# EAGLE design CO2Monitor V0.3 (EAGLE 9.6.2)
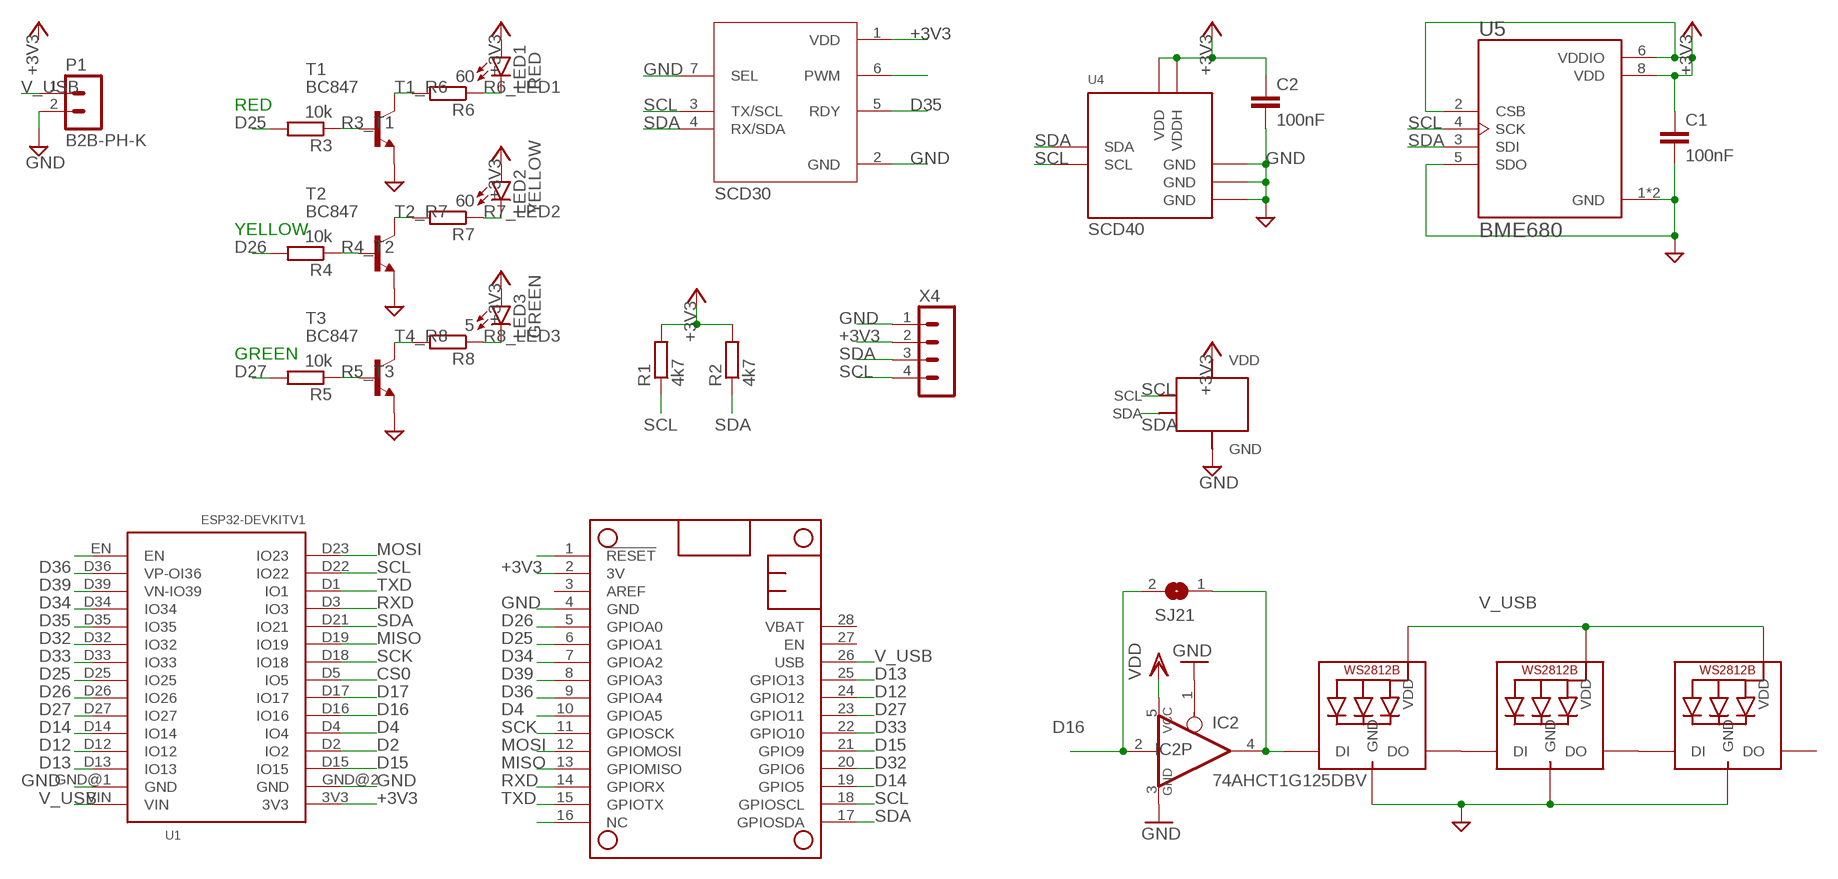
[diagram p0: schematic, sheet 1]

## Parts
C1  100nF  C-EUC0805  [C0805]
C2  100nF  C-EUC0805  [C0805]
IC2  74AHCT1G125DBV  [SOT23-5]
LED1  RED  LED5MM  [LED5MM]
LED2  YELLOW  LED5MM  [LED5MM]
LED3  GREEN  LED5MM  [LED5MM]
LED4  WS2812B5050  [WS2812B]
LED5  WS2812B5050  [WS2812B]
LED6  WS2812B5050  [WS2812B]
MS1  FEATHERWING_FOOTPRINTFOOTPRINT  [FEATHERWING_FOOTPRINT]
P1  B2B-PH-K  [B2B-PH-K]
R1  4k7  R-EU_R0805  [R0805]
R2  4k7  R-EU_R0805  [R0805]
R3  10k  R-EU_R0805  [R0805]
R4  10k  R-EU_R0805  [R0805]
R5  10k  R-EU_R0805  [R0805]
R6  60  R-EU_R0805  [R0805]
R7  60  R-EU_R0805  [R0805]
R8  5  R-EU_R0805  [R0805]
SJ21  SOLDERJUMPER  [SOLDERJUMPER_ARROW_NOPASTE]
T1  BC847  [SOT23]
T2  BC847  [SOT23]
T3  BC847  [SOT23]
U1  ESP32DEVKITV1  [ESP32-DEVKITV1]
U3  SCD30  [MODULE_SCD30]
U4  SCD40  [SCD40]
U5  BME680  [PSON80P300X300X100-8N]
X1  1306_0.96"1306_0.96"_NO_JHOLES  [1306_0.96"_NO_CUT]
X4  B4B-PH-K  [B4B-PH-K]

## Nets
+3V3: C1.1 C2.1 LED1.A LED2.A LED3.A MS1.2(3V) R1.2 R2.2 U1.3V3 U3.1(VDD) U4.P$7(VDD) U4.P$19(VDDH) U5.2(CSB) U5.6(VDDIO) U5.8(VDD) X1.VDD X4.2
CS0: U1.D5(IO5)
D2: U1.D2(IO2)
D4: MS1.10(GPIOA5) U1.D4(IO4)
D12: MS1.24(GPIO12) U1.D12(IO12)
D13: MS1.25(GPIO13) U1.D13(IO13)
D14: MS1.19(GPIO5) U1.D14(IO14)
D15: MS1.21(GPIO9) U1.D15(IO15)
D16: IC2.2(I) SJ21.2 U1.D16(IO16)
D17: U1.D17(IO17)
D25: MS1.6(GPIOA1) R3.2 U1.D25(IO25)
D26: MS1.5(GPIOA0) R4.2 U1.D26(IO26)
D27: MS1.23(GPIO11) R5.2 U1.D27(IO27)
D32: MS1.20(GPIO6) U1.D32(IO32)
D33: MS1.22(GPIO10) U1.D33(IO33)
D34: MS1.7(GPIOA2) U1.D34(IO34)
D35: U1.D35(IO35) U3.5(RDY)
D36: MS1.9(GPIOA4) U1.D36(VP-OI36)
D39: MS1.8(GPIOA3) U1.D39(VN-IO39)
GND: C1.2 C2.2 IC2.1(OE) IC2.3(GND) LED4.3-GND(GND) LED5.3-GND(GND) LED6.3-GND(GND) MS1.4(GND) P1.2 T1.2(E) T2.2(E) T3.2(E) U1.GND@1(GND) U1.GND@2(GND) U3.2(GND) U3.7(SEL) U4.P$6(GND) U4.P$20(GND) U4.P$21(GND) U5.1(GND) U5.5(SDO) U5.7(GND) X1.GND X4.1
MISO: MS1.13(GPIOMISO) U1.D19(IO19)
MOSI: MS1.12(GPIOMOSI) U1.D23(IO23)
N$1: LED4.2-DOUT(DO) LED5.4-DIN(DI)
N$2: U3.6(PWM)
N$3: MS1.16(NC)
N$4: LED5.2-DOUT(DO) LED6.4-DIN(DI)
N$8: MS1.1(!RESET)
N$17: U1.EN
N$22: IC2.4(O) LED4.4-DIN(DI) SJ21.1
R3_T1: R3.1 T1.1(B)
R4_T2: R4.1 T2.1(B)
R5_T3: R5.1 T3.1(B)
R6_LED1: LED1.K(C) R6.1
R7_LED2: LED2.K(C) R7.1
R8_LED3: LED3.K(C) R8.1
RXD: MS1.14(GPIORX) U1.D3(IO3)
SCK: MS1.11(GPIOSCK) U1.D18(IO18)
SCL: MS1.18(GPIOSCL) R1.1 U1.D22(IO22) U3.3(TX/SCL) U4.P$9(SCL) U5.4(SCK) X1.SCL X4.4
SDA: MS1.17(GPIOSDA) R2.1 U1.D21(IO21) U3.4(RX/SDA) U4.P$10(SDA) U5.3(SDI) X1.SDA X4.3
T1_R6: R6.2 T1.3(C)
T2_R7: R7.2 T2.3(C)
T4_R8: R8.2 T3.3(C)
TXD: MS1.15(GPIOTX) U1.D1(IO1)
V_USB: IC2.5(VCC) LED4.1-VDD(VDD) LED5.1-VDD(VDD) LED6.1-VDD(VDD) MS1.26(USB) P1.1 U1.VIN ; supply symbol labelled VDD
Unconnected: LED6.2-DOUT(DO) MS1.3(AREF) MS1.27(EN) MS1.28(VBAT)

## Notes on the sheet
- RED
- YELLOW
- GREEN

## Library data of the parts
C1 C2 = rcl:C-EU: CAPACITOR, European symbol; SPICEPREFIX: C
IC2 = 74xx-little-us:74*1G125: Single Bus Buffer Gate with 3-State Output
LED1-LED3 = led:LED: LED OSRAM: - CHIPLED LG R971, LG N971, LY N971, LG Q971, LY Q971, LO R971, LY R971 LH N974, LH R974 LS Q976, LO Q976, LY Q976 LO Q996 - Hyper CHIPLED LW Q18S LB Q993, LB Q99A, LB R99A - SideLED LS A670, LO A670, LY A670, LG A670, LP A670 LB A673, LV A673, LT A673, LW A673 LH A674 LY A675 LS A676, LA A676, LO A676, LY A676, LW A676 LS A679, LY A679, LG A679 - Hyper Micro SIDELED® LS Y876, LA Y876, LO Y876, LY Y876 LT Y87S - SmartLED LW L88C, LW L88S LB L89C, LB L89S, LG L890 LS L89K, LO L89K, LY L89K LS L896, LA L896, LO L896, LY L896 - TOPLED LS T670, LO T670, LY T670, LG T670, LP T670 LSG T670, LSP T670, LSY T670, LOP T670, LYG T670 LG T671, LOG T671, LSG T671 LB T673, LV T673, LT T673, LW T673 LH T674 LS T676, LA T676, LO T676, LY T676, LB T676, LH T676, LSB T676, LW T676 LB T67C, LV T67C, LT T67C, LS T67K, LO T67K, LY T67K, LW E67C LS E67B, LA E67B, LO E67B, LY E67B, LB E67C, LV E67C, LT E67C LW T67C LS T679, LY T679, LG T679 LS T770, LO T770, LY T770, LG T770, LP T770 LB T773, LV T773, LT T773, LW T773 LH T774 LS E675, LA E675, LY E675, LS T675 LS T776, LA T776, LO T776, LY T776, LB T776 LHGB T686 LT T68C, LB T68C - Hyper Mini TOPLED® LB M676 - Mini TOPLED Santana® LG M470 LS M47K, LO M47K, LY M47K Source: http://www.osram.convergy.de LUXEON: - LUMILED® LXK2-PW12-R00, LXK2-PW12-S00, LXK2-PW14-U00, LXK2-PW14-V00 LXK2-PM12-R00, LXK2-PM12-S00, LXK2-PM14-U00 LXK2-PE12-Q00, LXK2-PE12-R00, LXK2-PE12-S00, LXK2-PE14-T00, LXK2-PE14-U00 LXK2-PB12-K00, LXK2-PB12-L00, LXK2-PB12-M00, LXK2-PB14-N00, LXK2-PB14-P00, LXK2-PB14-Q00 LXK2-PR12-L00, LXK2-PR12-M00, LXK2-PR14-Q00, LXK2-PR14-R00 LXK2-PD12-Q00, LXK2-PD12-R00, LXK2-PD12-S00 LXK2-PH12-R00, LXK2-PH12-S00 LXK2-PL12-P00, LXK2-PL12-Q00, LXK2-PL12-R00 Source: www.luxeon.com KINGBRIGHT: KA-3528ASYC Source: www.kingbright.com
LED4-LED6 = WS2812B:WS2812B: Check prices <https://pricing.snapeda.com/parts/WS2812B/Worldsemi/view-part?ref=eda>; AVAILABILITY: Not in stock; DESCRIPTION: Raspberry Pi HAT (40 pin) Wheeled Robotics Kit; MF: Worldsemi; MP: WS2812B; PACKAGE: None; PRICE: None
MS1 = FeatherWing:FEATHERWING_FOOTPRINT
P1 = con-jst-ph:B2B-PH-K: HEADER
R1-R8 = rcl:R-EU_: RESISTOR, European symbol; SPICEPREFIX: R
SJ21 = microbuilder:SOLDERJUMPER: SMD Solder JUMPER Solder the two pads together to create a connection, or remove the solder to break it. REFLOW - Use this footprint for solder paste and reflow ovens. WAVE - Use this footprint for hand-soldering (larger pads). CLOSED - Has a trace between the two pads to ensure it is closed by default. The trace needs to be cut to disable the jumper, and can be closed again by creating a solder bridge between the two pads.; BOM: EXCLUDE
T1-T3 = transistor:BC847: NPN TRANSISTOR
U1 = ESP32-DEVKITV1:ESP32DEVKITV1
U3 = SCD30:SCD30: SCD30 Series 5.5 V 75 mA ±3% Carbon Dioxide (CO2) Sensor Module Check prices <https://pricing.snapeda.com/parts/SCD30/Sensirion%20AG/view-part?ref=eda>; AVAILABILITY: In Stock; DESCRIPTION: Carbon Dioxide (CO2) Sensor I²C, Modbus, PWM; MF: Sensirion AG; MP: SCD30; PACKAGE: None; PRICE: None; PURCHASE-URL: https://pricing.snapeda.com/search/part/SCD30/?ref=eda
U4 = SCD40:SCD40
U5 = BME680:BME680: Integrated Environmental Unit Check prices <https://pricing.snapeda.com/parts/BME680/Bosch%20Sensortec/view-part?ref=eda>; AVAILABILITY: In Stock; DESCRIPTION: Gas, Humidity, Pressure, Temperature Sensor I²C, SPI Output; MF: Bosch Sensortec; MP: BME680; PACKAGE: LGA-8 Bosch Tools; PRICE: None; PURCHASE-URL: https://pricing.snapeda.com/search/part/BME680/?ref=eda
X1 = SSD1306:1306_0.96"
X4 = con-jst-ph:B4B-PH-K: HEADER

## Board
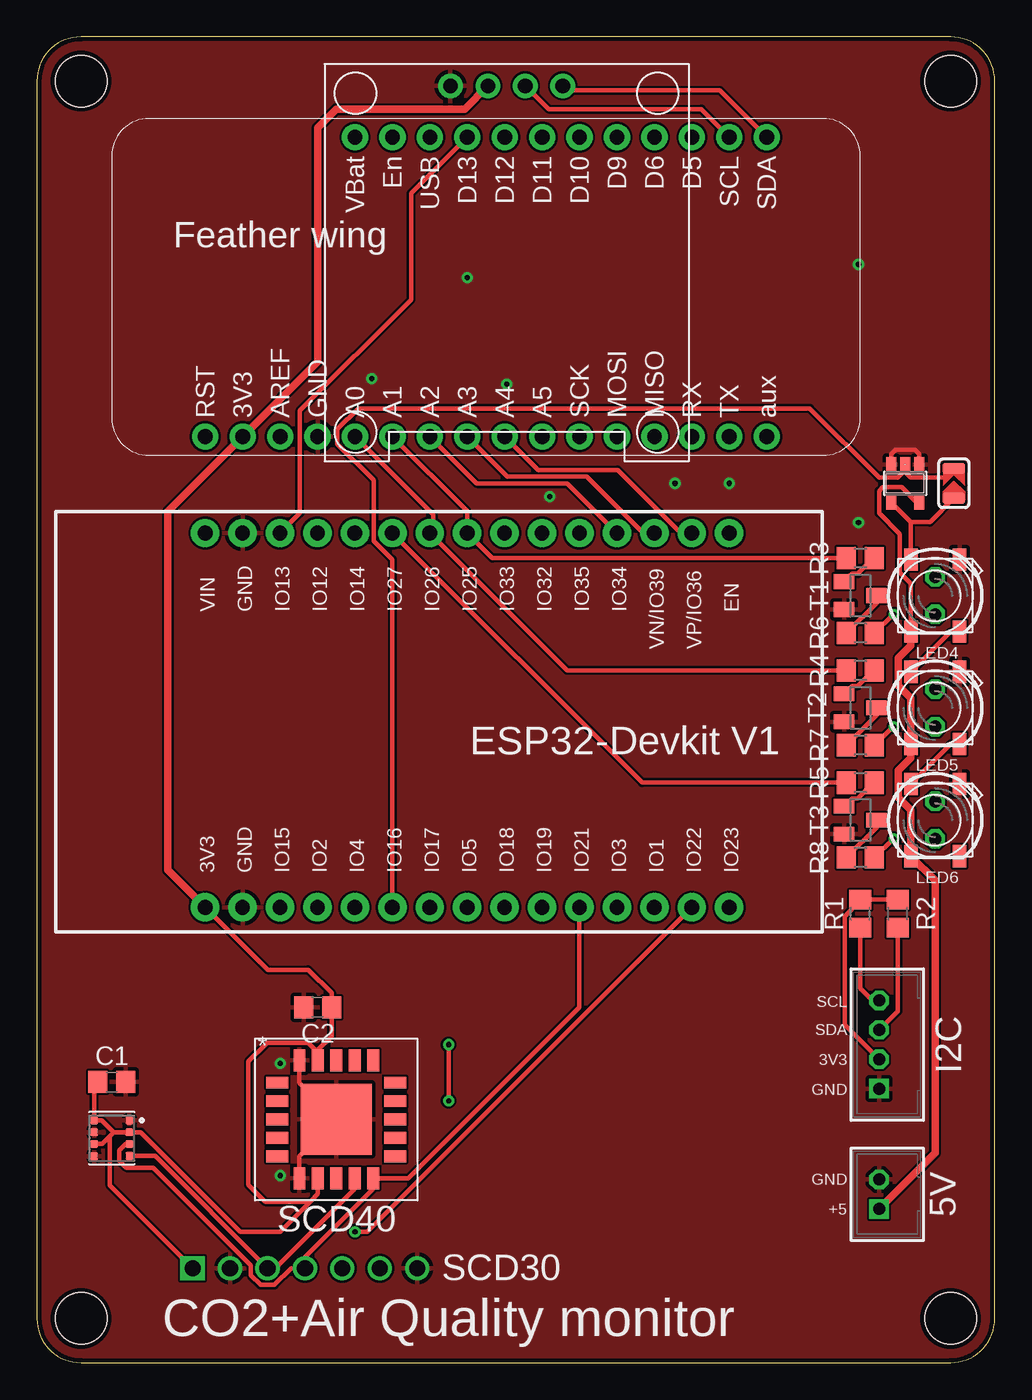
[diagram p1: board, top side]
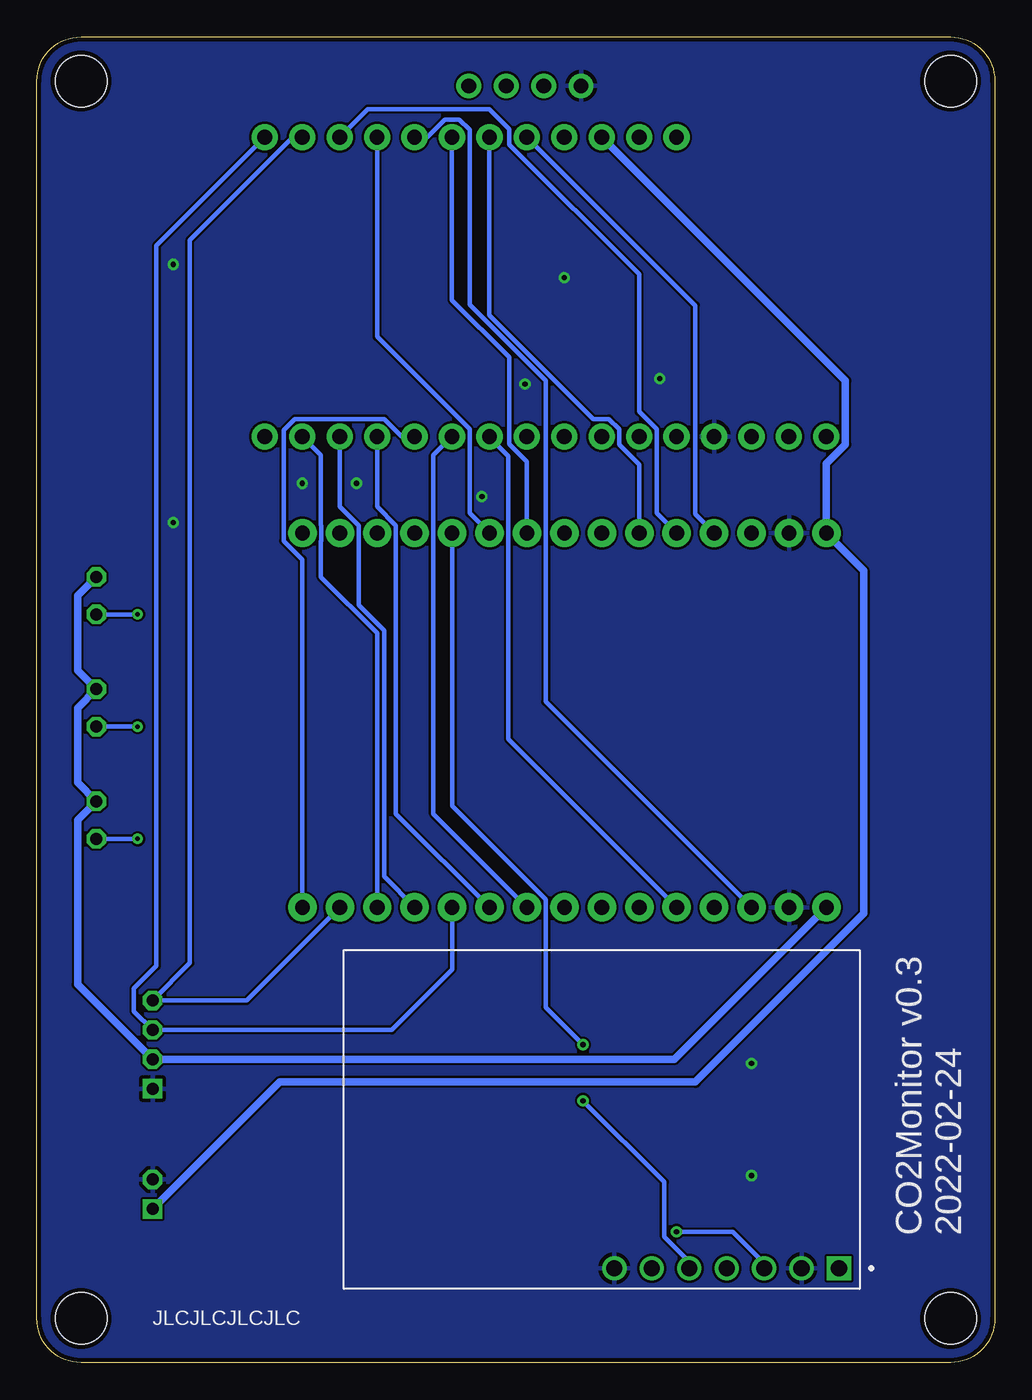
[diagram p2: board, bottom side, seen from below]

Size 65 x 90 mm. Coordinates in mm from the lower left corner, seen from the top.
Outline: 62,90 3,90 arc90 0,87 0,3 arc90 3,0 62,0 arc90 65,3 65,87 arc90 62,90
Copper layers (1*16): Top 0.035mm / dielectric 1.5mm / Bottom 0.035mm
Design rules "Seeed": minimum track width 6mil, minimum drill 0.3mm, track to track 6mil, track to pad 6mil, pad to pad 6mil, via to via 12mil, smd to smd 6mil, copper to edge 12mil, drill to drill 6mil, minimum pad ring 10mil, minimum via ring 8mil, stop-mask expansion 4mil, vias tented up to drill 20mil, thermal gap 10mil
Holes 3.5 mm at 3,3 62,3 62,87 3,87

### Footprints (pad centres in the part's own frame; a part is rotated, then mirrored left to right if it is on the bottom)
C0805 = smd 1.3 x 1.5: 1 -0.95,0; 2 0.95,0
SOT23-5 = smd 0.69 x 0.99: 1 -0.95,-1.29; 2 0,-1.29; 3 0.95,-1.29; 4 0.95,1.3; 5 -0.95,1.3
LED5MM = drill 0.813 octagon: A -1.27,0; K 1.27,0
WS2812B = smd 1.5 x 0.9: 1-VDD 2.45,-1.65; 2-DOUT 2.45,1.65; 3-GND -2.45,1.65; 4-DIN -2.45,-1.65
FEATHERWING_FOOTPRINT = drill 1 pad 1.778: 1 6.35,1.27; 2 8.89,1.27; 3 11.43,1.27; 4 13.97,1.27; 5 16.51,1.27; 6 19.05,1.27; 7 21.59,1.27; 8 24.13,1.27; 9 26.67,1.27; 10 29.21,1.27; 11 31.75,1.27; 12 34.29,1.27; 13 36.83,1.27; 14 39.37,1.27; 15 41.91,1.27; 16 44.45,1.27; 17 44.45,21.59; 18 41.91,21.59; 19 39.37,21.59; 20 36.83,21.59; 21 34.29,21.59; 22 31.75,21.59; 23 29.21,21.59; 24 26.67,21.59; 25 24.13,21.59; 26 21.59,21.59; 27 19.05,21.59; 28 16.51,21.59
B2B-PH-K = drill 0.813 square: 1 -1,0 | drill 0.813 octagon: 2 1,0
R0805 = smd 1.3 x 1.5: 1 -0.95,0; 2 0.95,0
SOLDERJUMPER_ARROW_NOPASTE = smd 0.762 x 1.524: 1 -1.016,0; 2 1.016,0
SOT23 = smd 1 x 1.4: 1 -0.95,-1.1; 2 0.95,-1.1; 3 0,1.1
ESP32-DEVKITV1 = drill 1 pad 1.93: 3V3 -16.52,-12.27; D1 13.96,-12.27; D2 -8.9,-12.27; D3 11.42,-12.27; D4 -6.36,-12.27; D5 1.26,-12.27; D12 -8.9,13.135; D13 -11.44,13.135; D14 -6.36,13.135; D15 -11.44,-12.27; D16 -3.82,-12.27; D17 -1.28,-12.27; D18 3.8,-12.27; D19 6.34,-12.27; D21 8.88,-12.27; D22 16.5,-12.27; D23 19.04,-12.27; D25 1.26,13.135; D26 -1.28,13.135; D27 -3.82,13.135; D32 6.34,13.135; D33 3.8,13.135; D34 11.42,13.135; D35 8.88,13.135; D36 16.5,13.135; D39 13.96,13.135; EN 19.04,13.135; GND@1 -13.98,13.135; GND@2 -13.98,-12.27; VIN -16.52,13.135
MODULE_SCD30 = drill 1.1 square: 1 -16.1,10.1 | drill 1.1: 2 -13.56,10.1; 3 -11.02,10.1; 4 -8.48,10.1; 5 -5.94,10.1; 6 -3.4,10.1; 7 -0.86,10.1
SCD40 = smd 1.5 x 0.8: P$1 -4,2.5; P$2 -4,1.25; P$3 -4,0; P$4 -4,-1.25; P$5 -4,-2.5; P$11 4,-2.5; P$12 4,-1.25; P$13 4,0; P$14 4,1.25; P$15 4,2.5 | smd 0.8 x 1.5: P$6 -2.5,-4; P$7 -1.25,-4; P$8 0,-4; P$9 1.25,-4; P$10 2.5,-4; P$16 2.5,4; P$17 1.25,4; P$18 0,4; P$19 -1.25,4; P$20 -2.5,4 | smd 4.8 x 4.8: P$21 0,0
PSON80P300X300X100-8N = smd 0.5 x 0.5: 1 1.2,1.2; 2 1.2,0.4; 3 1.2,-0.4; 4 1.2,-1.2; 5 -1.2,-1.22; 6 -1.2,-0.4; 7 -1.2,0.4; 8 -1.2,1.2
1306_0.96"_NO_CUT = drill 1 pad 1.676: GND -3.81,12; SCL 1.27,12; SDA 3.81,12; VDD -1.27,12
B4B-PH-K = drill 0.813 square: 1 -3,0 | drill 0.813 octagon: 2 -1,0; 3 1,0; 4 3,0

### Placement (x,y rotation side)
C1  5.08,19.05 0 top
C2  19.05,24.13 180 top
IC2  58.93,59.69 180 top
LED1  60.96,52.07 270 top
LED2  60.96,44.45 270 top
LED3  60.96,36.83 270 top
LED4  60.96,52.07 270 top
LED5  60.96,44.45 270 top
LED6  60.96,36.83 270 top
MS1  5.08,61.59 0 top
P1  57.15,11.43 90 top
R1  55.88,30.48 90 top
R2  58.42,30.48 90 top
R3  55.88,54.61 180 top
R4  55.88,46.99 180 top
R5  55.88,39.37 180 top
R6  55.88,49.53 180 top
R7  55.88,41.91 180 top
R8  55.88,34.29 180 top
SJ21  62.23,59.69 90 top
T1  55.88,52.07 270 top
T2  55.88,44.45 270 top
T3  55.88,36.83 270 top
U1  27.94,43.18 0 top
U3  26.67,16.51 180 bottom
U4  20.32,16.51 0 top
U5  5.08,15.24 0 top
X1  31.88,74.67 0 top
X4  57.15,21.59 90 top

### Tracks (layer width: path | path; a pad name or v marks a point on that pad's centre or on a via)
+3V3
  Top 0.305: R2.2 R1.2 55.88,31.36 54.83,30.31 54.83,22.91 X4.2 | 5.21,15.62 4.39,16.44 U5.8 3.88,18.8 C1.1 | 5.21,15.62 6.26,15.62 U5.2 7.06,15.65 13.82,8.89 16.51,8.89 18.54,10.92 | U5.6 4.43,14.84 4.95,15.37 | 4.95,15.37 5.21,15.62 | U3.1 4.95,12.03 4.95,15.37 | 18.54,10.92 19.07,11.45 U4.P$7 | 18.54,10.92 15.49,10.92 14.35,12.06 14.35,20.45 15.62,21.72 18.41,21.72 19.07,21.06 U4.P$19 19.07,21.23 20,22.16 C2.1 20,25.09 18.41,26.67 15.66,26.67 11.64,30.69 U1.3V3
  Top 0.508: 11.64,30.69 8.89,33.44 8.89,57.78 MS1.2 19.05,67.94 19.05,83.82 20.32,85.09 29.02,85.09 X1.VDD
  Bottom 0.508: U1.3V3 21.74,20.59 X4.2 62.23,25.67 62.23,36.83 LED3.A 62.23,39.37 62.23,44.45 LED2.A 62.23,46.99 62.23,52.07 LED1.A
D4
  Bottom 0.305: MS1.10 34.29,62.82 33.01,61.54 33.01,42.34 U1.D4
D12
  Bottom 0.305: U1.D12 20.32,57.59 20.32,71.75 MS1.24
D13
  Top 0.305: U1.D13 17.86,57.67 17.86,64.63 25.4,72.17 25.4,79.38 MS1.25
D14
  Bottom 0.305: U1.D14 22.94,57.67 22.94,63.36 24.13,64.55 24.13,73.88 32.94,82.69 32.94,83.74 34.29,85.09 42.55,85.09 MS1.19
D15
  Bottom 0.305: MS1.21 38.52,83.19 37.32,84.38 36.34,84.38 35.64,83.68 35.64,71.82 30.48,66.66 30.48,56.85 30.47,56.84 30.47,44.88 U1.D15
D16
  Top 0.305: SJ21.2 61.59,60.07 59.31,60.07 58.93,60.45 IC2.2 58.93,60.58 58.42,60.07 57.15,60.07 52.45,64.77 21.81,64.77 20.4,63.36 20.4,62.37 22.85,59.92 22.85,55.79 24.12,54.52 U1.D16
D25
  Top 0.305: R3.2 30.91,54.61 U1.D25 29.2,57.8 MS1.6
D26
  Top 0.305: R4.2 35.98,46.99 26.88,56.09 | 26.88,56.09 U1.D26 | MS1.5 26.88,57.57 26.88,56.09
D27
  Top 0.305: R5.2 41.06,39.37 U1.D27
  Bottom 0.305: MS1.23 34.29,71.12 27.23,64.06 26.18,64.06 25.48,63.36 25.48,62.31 24.12,60.95 U1.D27
D32
  Bottom 0.305: U1.D32 35.64,57.67 35.64,63.36 41.91,69.63 MS1.20
D33
  Bottom 0.305: MS1.22 36.83,72.14 32.94,68.25 32.94,62.37 31.74,61.17 U1.D33
D34
  Top 0.305: MS1.7 29.84,59.69 35.98,59.69 U1.D34
D35  (via drill 0.35)
  Top 0.305: v27.94,17.78 v27.94,21.59
  Bottom 0.305: U1.D35 36.82,37.79 30.47,31.44 30.47,24.12 v27.94,21.59 | U3.5 20.73,6.85 22.43,8.54 22.43,12.27 v27.94,17.78
D36
  Top 0.305: MS1.9 34.01,60.6 39.41,60.6 43.7,56.31 U1.D36
D39
  Top 0.305: MS1.8 31.93,60.15 37.32,60.15 41.16,56.31 U1.D39
GND  (via drill 0.35)
  Top 0.305: IC2.3 57.98,61.66 58.29,61.98 59.56,61.98 59.88,61.66 IC2.1 | U4.P$20 17.82,19.01 U4.P$21 17.82,14.01 U4.P$6
  other vias: 16.51,20.32 16.51,12.7 29.21,73.66 22.73,66.8 31.88,66.42 46.99,59.69 43.31,59.69 34.8,58.8 55.75,74.55 55.75,57.02
  pour Top: -2.54,-2.54 72.39,-2.54 72.39,91.44 -2.54,91.44
  pour Bottom: -5.08,-5.08 73.66,-5.08 73.66,92.71 -5.08,92.71
MISO
  Bottom 0.305: MS1.13 41.91,58.12 40.63,56.84 40.63,37.26 U1.D19
MOSI
  Bottom 0.305: U1.D23 46.98,54.52 48.25,55.79 48.25,63.29 47.48,64.06 41.42,64.06 40.22,62.87 MS1.12
N$1
  Top 0.305: LED5.4-DIN 62.03,49.62 LED4.2-DOUT
N$4
  Top 0.305: LED6.4-DIN 62.03,42 LED5.2-DOUT
N$22
  Top 0.305: LED4.4-DIN 59.31,57.06 | 59.31,57.06 IC2.4 | SJ21.1 60.61,57.06 59.31,57.06
R3_T1
  Top 0.305: T1.1 55.31,53.55 55.71,53.55 56.76,54.61 R3.1
R4_T2
  Top 0.305: T2.1 55.31,45.94 55.71,45.94 56.76,46.99 R4.1
R5_T3
  Top 0.305: T3.1 55.31,38.31 55.71,38.31 56.76,39.37 R5.1
R6_LED1  (via drill 0.3)
  Top 0.305: R6.1 58.1,50.8 v58.17,50.8
  Bottom 0.305: v58.17,50.8 LED1.K
R7_LED2  (via drill 0.3)
  Top 0.305: R7.1 58.1,43.18 v58.17,43.18
  Bottom 0.305: v58.17,43.18 LED2.K
R8_LED3  (via drill 0.3)
  Top 0.305: R8.1 58.1,35.56 v58.17,35.56
  Bottom 0.305: v58.17,35.56 LED3.K
RXD
  Bottom 0.305: U1.D3 41.44,32.99 41.44,49.71 43.17,51.44 43.17,56.84 44.45,58.12 MS1.14
SCK
  Bottom 0.305: U1.D18 38.09,37.26 38.09,56.84 38.1,56.85 38.1,61.59 MS1.11
SCL  (via drill 0.35)
  Top 0.305: R1.1 55.88,25.4 56.69,24.59 X4.4 | U4.P$9 21.53,12.47 21.53,11.76 16.18,6.41 U3.3 8.02,14.04 U5.4 | U1.D22 22.42,8.89 v21.59,8.89 | X1.SCL 34.73,85.09 45.09,85.09 MS1.18
  Bottom 0.305: v21.59,8.89 17.78,8.89 15.65,6.76 U3.3 | MS1.18 47.62,83.19 54.61,76.2 54.61,27.13 X4.4 50.76,24.59 U1.D22
SDA
  Top 0.305: R2.1 58.42,23.86 X4.3 | U5.3 6.03,14.84 5.6,14.41 5.6,13.7 6.07,13.23 7.89,13.23 14.52,6.6 14.52,5.94 15.18,5.28 16.12,5.28 17.25,6.41 U3.4 18.19,7.17 22.78,11.76 22.78,12.47 U4.P$10 25.21,12.51 36.82,24.12 U1.D21 | X1.SDA 36,86.36 46.35,86.36 MS1.17
  Bottom 0.305: MS1.17 56.9,75.82 56.9,26.92 58.42,25.4 58.42,23.86 X4.3 40.91,22.59 36.82,26.68 U1.D21
T1_R6
  Top 0.305: R6.2 56.98,51.58 T1.3
T2_R7
  Top 0.305: R7.2 56.98,43.96 T2.3
T4_R8
  Top 0.305: R8.2 56.98,36.34 T3.3
TXD
  Bottom 0.305: U1.D1 41.9,49.52 45.72,53.34 45.72,55.78 45.71,55.79 45.71,56.84 45.72,56.85 45.72,61.59 MS1.15
V_USB
  Top 0.305: LED4.1-VDD 59.31,52.89 58.55,53.64 58.55,56.25 57.15,57.66 57.15,59.18 57.4,59.44 58.67,59.44 59.72,58.39 IC2.5
  Top 0.508: LED4.1-VDD 59.31,48.67 58.45,47.82 58.45,45.98 59.31,45.12 LED5.1-VDD 59.31,41.05 58.45,40.2 58.45,38.36 59.31,37.51 LED6.1-VDD 60.96,32.73 60.96,14.24 P1.1
  Bottom 0.508: MS1.26 10.13,66.65 10.13,62.33 11.42,61.04 U1.VIN 8.89,53.78 8.89,30.48 20.32,19.05 48.53,19.05 P1.1

### Text on the board
tNames: Feather wing | SCL | SDA | I2C | 3V3 | GND | GND | 5V | +5 | SCD40 | SCD30 | CO2+Air Quality monitor
bNames: CO2Monitor v0.3 / 2022-02-24 | JLCJLCJLCJLC